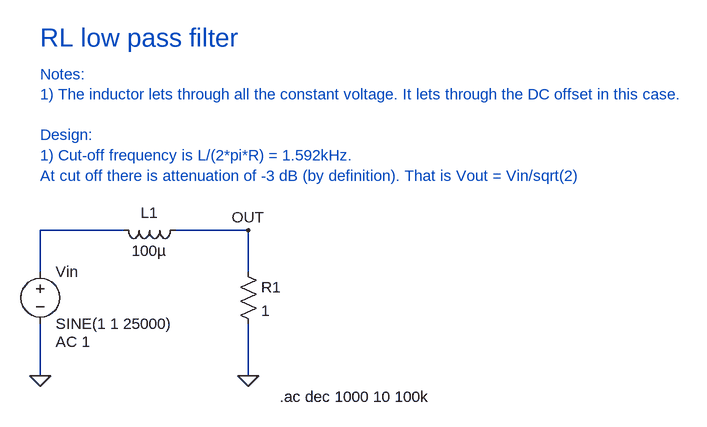
[diagram p0: schematic RL-lowpass.asc]
RL-lowpass.asc, the LTspice schematic file:
Version 4.1
SHEET 1 1164 680
WIRE 208 48 80 48
WIRE 400 48 288 48
WIRE 80 112 80 48
WIRE 400 112 400 48
WIRE 80 272 80 192
WIRE 400 272 400 192
FLAG 80 272 0
FLAG 400 272 0
FLAG 400 48 OUT
SYMBOL voltage 80 96 R0
WINDOW 123 24 124 Left 2
WINDOW 39 0 0 Left 2
SYMATTR Value2 AC 1
SYMATTR InstName Vin
SYMATTR Value SINE(1 1 25000)
SYMBOL ind 304 32 R90
WINDOW 0 5 56 VBottom 2
WINDOW 3 32 56 VTop 2
SYMATTR InstName L1
SYMATTR Value 100µ
SYMBOL res 384 96 R0
SYMATTR InstName R1
SYMATTR Value 1
TEXT 448 304 Left 2 !.ac dec 1000 10 100k
TEXT 80 -248 Left 4 ;RL low pass filter
TEXT 80 -192 Left 2 ;Notes:\n1) The inductor lets through all the constant voltage. It lets through the DC offset in this case.\n \nDesign:\n1) Cut-off frequency is L/(2*pi*R) = 1.592kHz.\nAt cut off there is attenuation of -3 dB (by definition). That is Vout = Vin/sqrt(2)

The netlist it stands for:
* RL-lowpass.asc
Vin N001 0 SINE(1 1 25000) AC 1
L1 OUT N001 100µ
R1 OUT 0 1
.ac dec 1000 10 100k
* RL low pass filter
* Notes:
* 1) The inductor lets through all the constant voltage. It lets through the DC offset in this case.
* Design:
* 1) Cut-off frequency is L/(2*pi*R) = 1.592kHz.
* At cut off there is attenuation of -3 dB (by definition). That is Vout = Vin/sqrt(2)
.backanno
.end